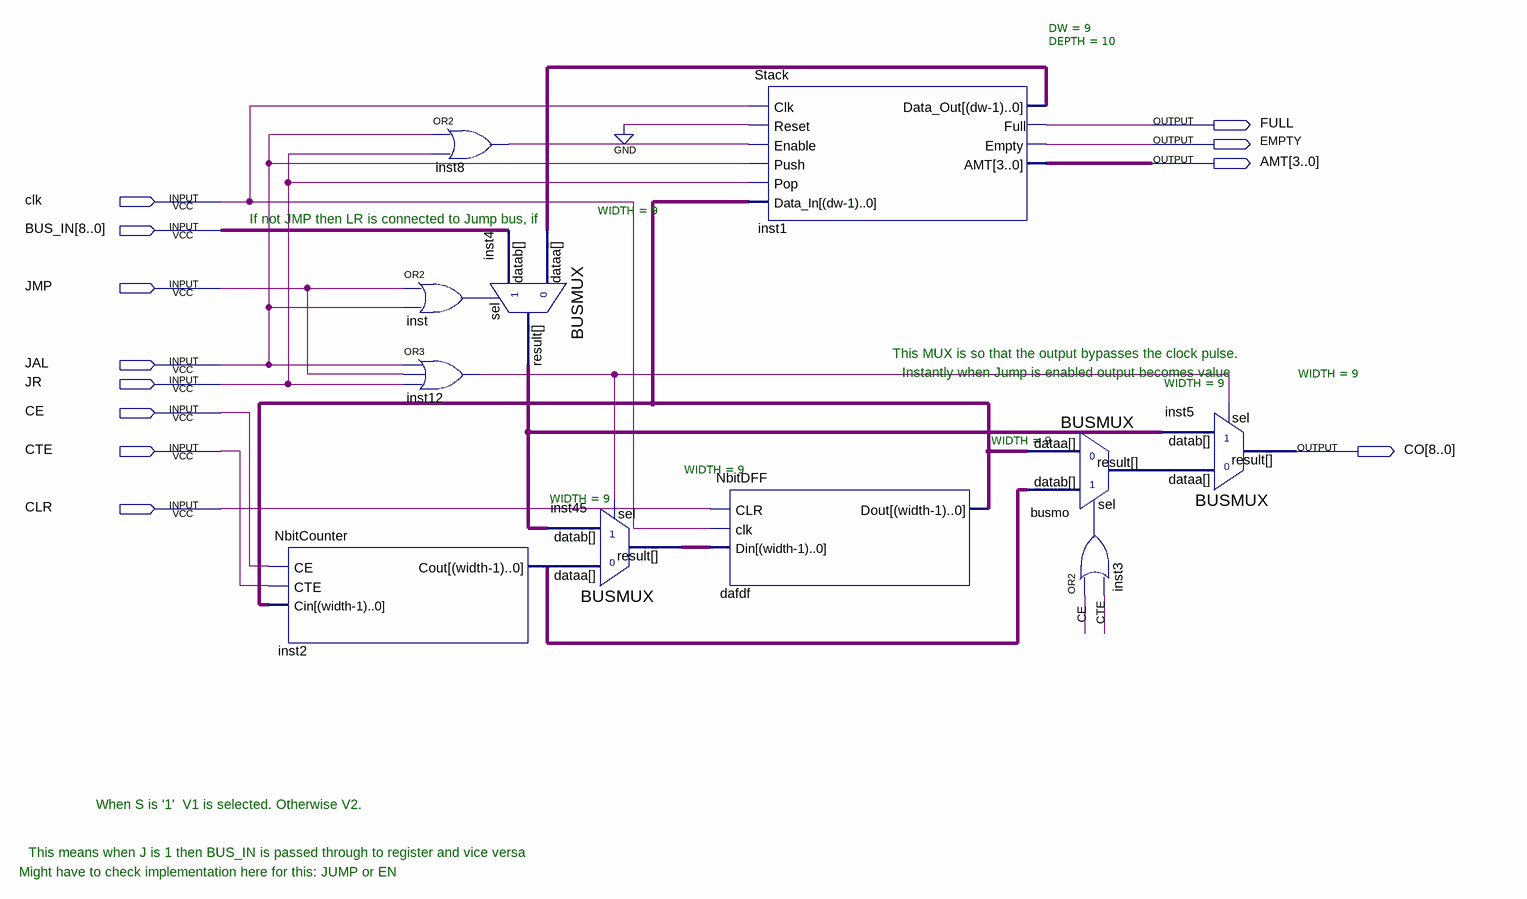
[diagram p0: schematic sheet]
// Quartus schematic ProgramCounter.bdf as structural Verilog: 11 symbols, 12 pins
module ProgramCounter (
  input  clk,
  input  [8:0] BUS_IN,
  input  JMP,
  input  JAL,
  input  JR,
  input  CE,
  input  CTE,
  input  CLR,
  output FULL,
  output EMPTY,
  output [3:0] AMT,
  output [8:0] CO
);

  wire inst3_out, inst8_out, inst12_out, inst_out;
  wire [8:0] busmo_result, dafdf_dout, inst1_data_out, inst2_cout, inst4_result, inst45_result;

  NbitCounter #(.WIDTH(9)) inst2 (.CE(CE), .CTE(CTE), .Cin(dafdf_dout), .Cout(inst2_cout));
  or inst8 (inst8_out, JAL, JR);
  or inst (inst_out, JMP, JAL);
  or inst12 (inst12_out, JAL, JMP, JR);
  BUSMUX #(.WIDTH(9)) inst4 (.datab(BUS_IN), .sel(inst_out), .dataa(inst1_data_out), .result(inst4_result));
  BUSMUX #(.WIDTH(9)) inst45 (.datab(inst4_result), .sel(inst12_out), .dataa(inst2_cout), .result(inst45_result));
  Stack #(.DW(9), .DEPTH(10)) inst1 (
    .Clk(clk), .Reset(1'b0), .Enable(inst8_out), .Push(JAL), .Pop(JR), .Data_In(dafdf_dout),
    .Data_Out(inst1_data_out), .Full(FULL), .Empty(EMPTY), .AMT(AMT));
  NbitDFF #(.WIDTH(9)) dafdf (.CLR(CLR), .clk(clk), .Din(inst45_result), .Dout(dafdf_dout));
  BUSMUX #(.WIDTH(9)) busmo (.datab(inst2_cout), .sel(inst3_out), .dataa(dafdf_dout), .result(busmo_result));
  or inst3 (inst3_out, CE, CTE);
  BUSMUX #(.WIDTH(9)) inst5 (.datab(inst4_result), .sel(inst12_out), .dataa(busmo_result), .result(CO));

  // Notes on the sheet:
  //   If not JMP then LR is connected to Jump bus, if
  //   This MUX is so that the output bypasses the clock pulse.
  //   Instantly when Jump is enabled output becomes value
  //   When S is '1'  V1 is selected. Otherwise V2.
  //   This means when J is 1 then BUS_IN is passed through to register and vice versa
  //   Might have to check implementation here for this: JUMP or EN
endmodule
